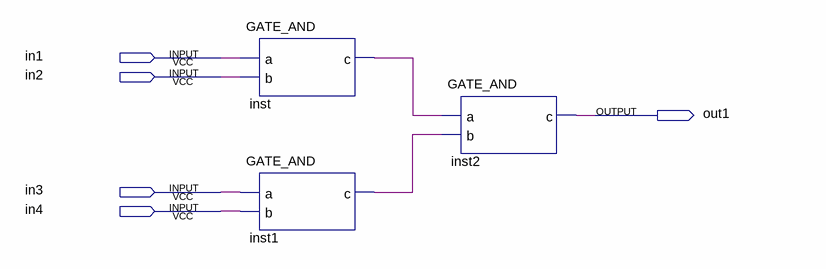
[diagram p0: schematic sheet]
// Quartus schematic GATE_AND_blocks.bdf as structural Verilog: 3 symbols, 5 pins
module GATE_AND_blocks (
  input  in1,
  input  in2,
  input  in3,
  input  in4,
  output out1
);

  wire inst1_c, inst_c;

  GATE_AND inst (.a(in1), .b(in2), .c(inst_c));
  GATE_AND inst1 (.a(in3), .b(in4), .c(inst1_c));
  GATE_AND inst2 (.a(inst_c), .b(inst1_c), .c(out1));
endmodule
